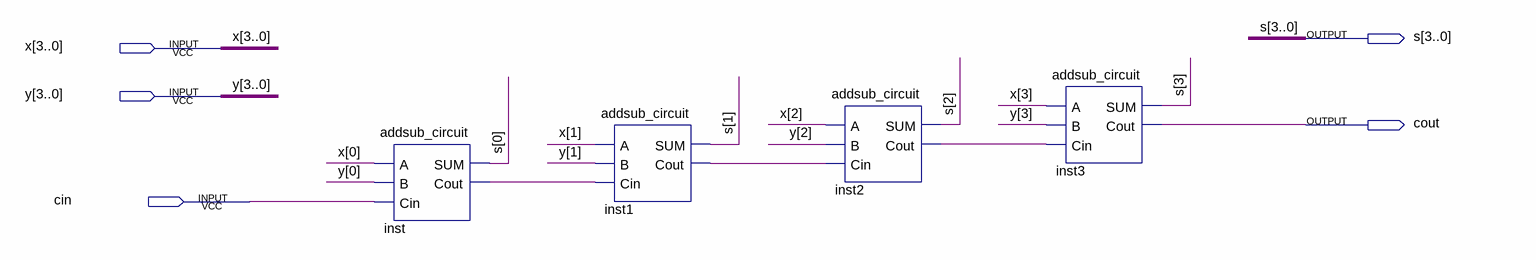
[diagram p0: schematic sheet]
// Quartus schematic add_sub.bdf as structural Verilog: 4 symbols, 5 pins
module add_sub (
  input  [3:0] x,
  input  [3:0] y,
  input  cin,
  output [3:0] s,
  output cout
);

  wire inst1_cout, inst2_cout, inst_cout;

  addsub_circuit inst (.A(x[0]), .B(y[0]), .Cin(cin), .SUM(s[0]), .Cout(inst_cout));
  addsub_circuit inst1 (.A(x[1]), .B(y[1]), .Cin(inst_cout), .SUM(s[1]), .Cout(inst1_cout));
  addsub_circuit inst2 (.A(x[2]), .B(y[2]), .Cin(inst1_cout), .SUM(s[2]), .Cout(inst2_cout));
  addsub_circuit inst3 (.A(x[3]), .B(y[3]), .Cin(inst2_cout), .SUM(s[3]), .Cout(cout));
endmodule
